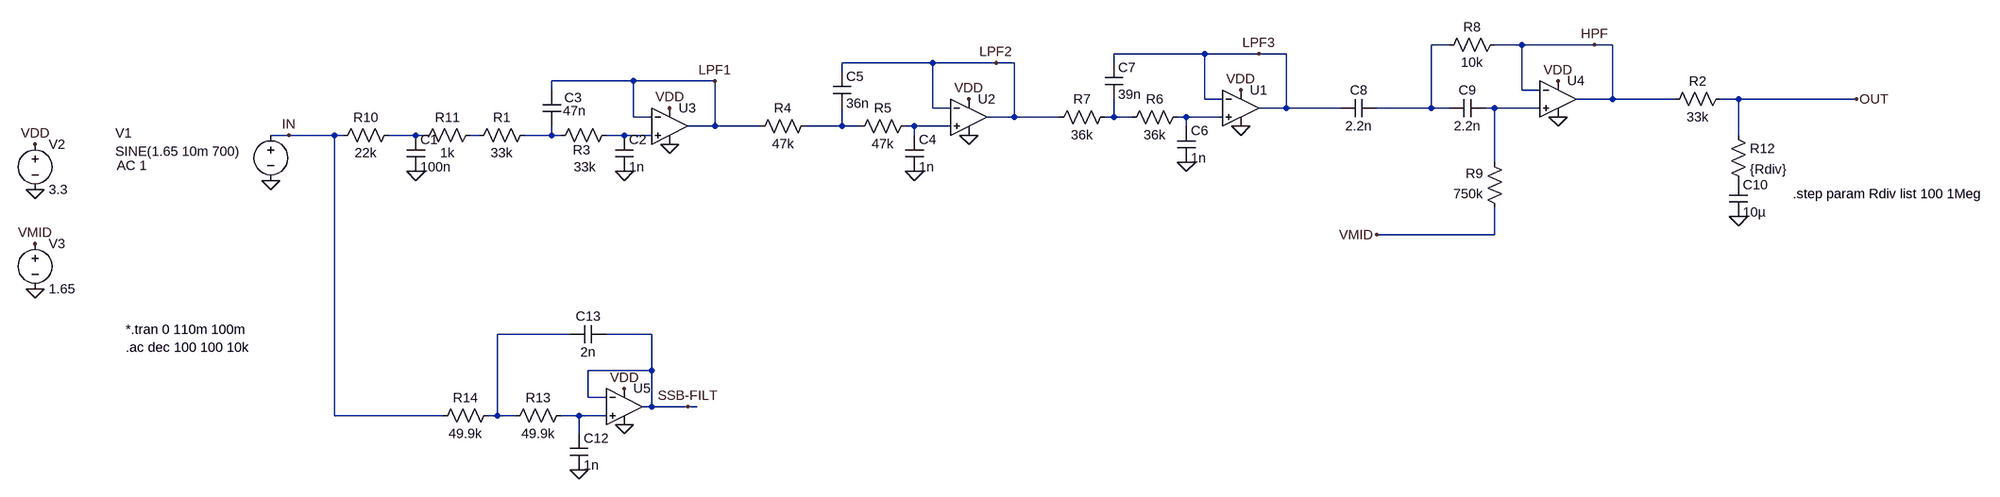
[diagram p0: schematic max-3b_2-1.asc]
max-3b_2-1.asc, the LTspice schematic file:
Version 4
SHEET 1 3216 724
WIRE 1888 -304 1856 -304
WIRE 2016 -304 1968 -304
WIRE 2144 -304 2016 -304
WIRE 2176 -304 2144 -304
WIRE 1456 -288 1296 -288
WIRE 1552 -288 1456 -288
WIRE 1600 -288 1552 -288
WIRE 976 -272 816 -272
WIRE 1088 -272 976 -272
WIRE 1120 -272 1088 -272
WIRE 1296 -272 1296 -288
WIRE 816 -256 816 -272
WIRE 448 -240 304 -240
WIRE 592 -240 448 -240
WIRE 304 -224 304 -240
WIRE 2016 -224 2016 -304
WIRE 2048 -224 2016 -224
WIRE 1456 -208 1456 -288
WIRE 1488 -208 1456 -208
WIRE 2176 -208 2176 -304
WIRE 2176 -208 2112 -208
WIRE 2368 -208 2176 -208
WIRE 2480 -208 2448 -208
WIRE 2688 -208 2480 -208
WIRE 976 -192 976 -272
WIRE 1008 -192 976 -192
WIRE 1600 -192 1600 -288
WIRE 1600 -192 1552 -192
WIRE 1696 -192 1600 -192
WIRE 1856 -192 1856 -304
WIRE 1856 -192 1760 -192
WIRE 1888 -192 1856 -192
WIRE 1968 -192 1952 -192
WIRE 2048 -192 1968 -192
WIRE 448 -176 448 -240
WIRE 480 -176 448 -176
WIRE 1120 -176 1120 -272
WIRE 1120 -176 1072 -176
WIRE 1200 -176 1120 -176
WIRE 1296 -176 1296 -208
WIRE 1296 -176 1280 -176
WIRE 1328 -176 1296 -176
WIRE 1424 -176 1408 -176
WIRE 1488 -176 1424 -176
WIRE 592 -160 592 -240
WIRE 592 -160 544 -160
WIRE 672 -160 592 -160
WIRE 816 -160 816 -192
WIRE 816 -160 752 -160
WIRE 848 -160 816 -160
WIRE 944 -160 928 -160
WIRE 1008 -160 944 -160
WIRE 1424 -160 1424 -176
WIRE -160 -144 -192 -144
WIRE -80 -144 -160 -144
WIRE -64 -144 -80 -144
WIRE 64 -144 16 -144
WIRE 80 -144 64 -144
WIRE 176 -144 160 -144
WIRE 304 -144 304 -160
WIRE 304 -144 256 -144
WIRE 320 -144 304 -144
WIRE 432 -144 400 -144
WIRE 480 -144 432 -144
WIRE 944 -144 944 -160
WIRE 2480 -144 2480 -208
WIRE 1968 -96 1968 -192
WIRE 1968 32 1968 -16
WIRE 1968 32 1760 32
WIRE 336 208 208 208
WIRE 480 208 400 208
WIRE 480 272 480 208
WIRE 480 272 368 272
WIRE 368 320 368 272
WIRE 400 320 368 320
WIRE 480 336 480 272
WIRE 480 336 464 336
WIRE 544 336 480 336
WIRE 560 336 544 336
WIRE -80 352 -80 -144
WIRE 112 352 -80 352
WIRE 208 352 208 208
WIRE 208 352 192 352
WIRE 240 352 208 352
WIRE 352 352 320 352
WIRE 400 352 352 352
WIRE 352 384 352 352
FLAG -608 -48 0
FLAG -608 -128 VDD
FLAG -192 -64 0
FLAG 432 -80 0
FLAG 944 -80 0
FLAG 1424 -96 0
FLAG 2080 -240 VDD
FLAG 2080 -176 0
FLAG 1520 -224 VDD
FLAG 1520 -160 0
FLAG 1040 -208 VDD
FLAG 1040 -144 0
FLAG 512 -192 VDD
FLAG 512 -128 0
FLAG 592 -240 LPF1
FLAG 1088 -272 LPF2
FLAG 1552 -288 LPF3
FLAG 2144 -304 HPF
FLAG 2688 -208 OUT
FLAG -160 -144 IN
FLAG -608 128 0
FLAG -608 48 VMID
FLAG 1760 32 VMID
FLAG 2480 0 0
FLAG 432 304 VDD
FLAG 432 368 0
FLAG 544 336 SSB-FILT
FLAG 352 448 0
FLAG 64 -80 0
SYMBOL voltage -192 -160 R0
WINDOW 123 -272 70 Left 2
WINDOW 39 0 0 Left 0
WINDOW 0 -274 12 Left 2
WINDOW 3 -274 45 Left 2
SYMATTR Value2 AC 1
SYMATTR InstName V1
SYMATTR Value SINE(1.65 10m 700)
SYMBOL voltage -608 -144 R0
WINDOW 123 0 0 Left 0
WINDOW 39 0 0 Left 0
SYMATTR InstName V2
SYMATTR Value 3.3
SYMBOL res 272 -160 R90
WINDOW 0 0 56 VBottom 2
WINDOW 3 32 56 VTop 2
SYMATTR InstName R1
SYMATTR Value 33k
SYMBOL res 416 -160 R90
WINDOW 0 58 59 VBottom 2
WINDOW 3 57 54 VTop 2
SYMATTR InstName R3
SYMATTR Value 33k
SYMBOL cap 416 -144 R0
SYMATTR InstName C2
SYMATTR Value 1n
SYMBOL cap 288 -224 R0
WINDOW 0 38 14 Left 2
WINDOW 3 36 37 Left 2
SYMATTR InstName C3
SYMATTR Value 47n
SYMBOL res 768 -176 R90
WINDOW 0 0 56 VBottom 2
WINDOW 3 32 56 VTop 2
SYMATTR InstName R4
SYMATTR Value 47k
SYMBOL res 944 -176 R90
WINDOW 0 0 56 VBottom 2
WINDOW 3 32 56 VTop 2
SYMATTR InstName R5
SYMATTR Value 47k
SYMBOL cap 928 -144 R0
SYMATTR InstName C4
SYMATTR Value 1n
SYMBOL cap 800 -256 R0
SYMATTR InstName C5
SYMATTR Value 36n
SYMBOL res 1424 -192 R90
WINDOW 0 0 56 VBottom 2
WINDOW 3 32 56 VTop 2
SYMATTR InstName R6
SYMATTR Value 36k
SYMBOL cap 1408 -160 R0
SYMATTR InstName C6
SYMATTR Value 1n
SYMBOL cap 1280 -272 R0
SYMATTR InstName C7
SYMATTR Value 39n
SYMBOL res 1296 -192 R90
WINDOW 0 0 56 VBottom 2
WINDOW 3 32 56 VTop 2
SYMATTR InstName R7
SYMATTR Value 36k
SYMBOL cap 1760 -208 R90
WINDOW 0 0 32 VBottom 2
WINDOW 3 32 32 VTop 2
SYMATTR InstName C8
SYMATTR Value 2.2n
SYMBOL OpAmps\\UniversalOpAmp 2080 -208 R0
SYMATTR InstName U4
SYMBOL res 1984 -320 R90
WINDOW 0 0 56 VBottom 2
WINDOW 3 32 56 VTop 2
SYMATTR InstName R8
SYMATTR Value 10k
SYMBOL cap 1952 -208 R90
WINDOW 0 0 32 VBottom 2
WINDOW 3 32 32 VTop 2
SYMATTR InstName C9
SYMATTR Value 2.2n
SYMBOL res 1984 0 R180
WINDOW 0 36 76 Left 2
WINDOW 3 36 40 Left 2
SYMATTR InstName R9
SYMATTR Value 750k
SYMBOL OpAmps\\UniversalOpAmp 1520 -192 R0
SYMATTR InstName U1
SYMBOL OpAmps\\UniversalOpAmp 1040 -176 R0
SYMATTR InstName U2
SYMBOL OpAmps\\UniversalOpAmp 512 -160 R0
SYMATTR InstName U3
SYMBOL voltage -608 32 R0
WINDOW 123 0 0 Left 0
WINDOW 39 0 0 Left 0
SYMATTR InstName V3
SYMATTR Value 1.65
SYMBOL res 2464 -224 R90
WINDOW 0 0 56 VBottom 2
WINDOW 3 32 56 VTop 2
SYMATTR InstName R2
SYMATTR Value 33k
SYMBOL res 2464 -160 R0
SYMATTR InstName R12
SYMATTR Value {Rdiv}
SYMBOL cap 2464 -64 R0
SYMATTR InstName C10
SYMATTR Value 10µ
SYMBOL OpAmps\\UniversalOpAmp 432 336 R0
SYMATTR InstName U5
SYMBOL res 336 336 R90
WINDOW 0 0 56 VBottom 2
WINDOW 3 32 56 VTop 2
SYMATTR InstName R13
SYMATTR Value 49.9k
SYMBOL res 208 336 R90
WINDOW 0 0 56 VBottom 2
WINDOW 3 32 56 VTop 2
SYMATTR InstName R14
SYMATTR Value 49.9k
SYMBOL cap 336 384 R0
SYMATTR InstName C12
SYMATTR Value 1n
SYMBOL cap 400 192 R90
WINDOW 0 0 32 VBottom 2
WINDOW 3 32 32 VTop 2
SYMATTR InstName C13
SYMATTR Value 2n
SYMBOL res 32 -160 R90
WINDOW 0 0 56 VBottom 2
WINDOW 3 32 56 VTop 2
SYMATTR InstName R10
SYMATTR Value 22k
SYMBOL res 176 -160 R90
WINDOW 0 0 56 VBottom 2
WINDOW 3 32 56 VTop 2
SYMATTR InstName R11
SYMATTR Value 1k
SYMBOL cap 48 -144 R0
SYMATTR InstName C1
SYMATTR Value 100n
TEXT -448 200 Left 2 !*.tran 0 110m 100m\n.ac dec 100 100 10k
TEXT 2576 -40 Left 2 !.step param Rdiv list 100 1Meg

The netlist it stands for:
* max-3b_2-1.asc
V1 IN 0 SINE(1.65 10m 700) AC 1
V2 VDD 0 3.3
R1 N009 N008 33k
R3 N010 N009 33k
C2 N010 0 1n
C3 LPF1 N009 47n
R4 N005 LPF1 47k
R5 N006 N005 47k
C4 N006 0 1n
C5 LPF2 N005 36n
R6 N004 N003 36k
C6 N004 0 1n
C7 LPF3 N003 39n
R7 N003 LPF2 36k
C8 N001 LPF3 2.2n
XU4 N002 HPF VDD 0 HPF level1 Avol=1Meg GBW=10Meg Vos=0 En=0 Enk=0 In=0 Ink=0 Rin=500Meg  ; pins In+ In- V+ V- OUT
R8 HPF N001 10k
C9 N002 N001 2.2n
R9 VMID N002 750k
XU1 N004 LPF3 VDD 0 LPF3 level1 Avol=1Meg GBW=10Meg Vos=0 En=0 Enk=0 In=0 Ink=0 Rin=500Meg  ; pins In+ In- V+ V- OUT
XU2 N006 LPF2 VDD 0 LPF2 level1 Avol=1Meg GBW=10Meg Vos=0 En=0 Enk=0 In=0 Ink=0 Rin=500Meg  ; pins In+ In- V+ V- OUT
XU3 N010 LPF1 VDD 0 LPF1 level1 Avol=1Meg GBW=10Meg Vos=0 En=0 Enk=0 In=0 Ink=0 Rin=500Meg  ; pins In+ In- V+ V- OUT
V3 VMID 0 1.65
R2 OUT HPF 33k
R12 OUT P001 {Rdiv}
C10 P001 0 10µ
XU5 N012 SSB-FILT VDD 0 SSB-FILT level1 Avol=1Meg GBW=10Meg Vos=0 En=0 Enk=0 In=0 Ink=0 Rin=500Meg  ; pins In+ In- V+ V- OUT
R13 N012 N011 49.9k
R14 N011 IN 49.9k
C12 N012 0 1n
C13 SSB-FILT N011 2n
R10 N007 IN 22k
R11 N008 N007 1k
C1 N007 0 100n
*.tran 0 110m 100m
.ac dec 100 100 10k
.step param Rdiv list 100 1Meg
.lib UniversalOpAmp1.lib
.backanno
.end